# Altium schematic sheet Power.SchDoc
size A4
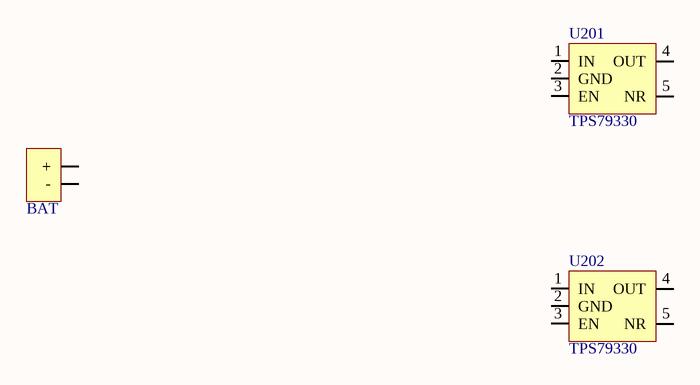
[diagram p0: Power.SchDoc]

## Parts
*  BAT
U201  TPS79330
U202  TPS79330

## Nets

Not connected (* = marked no-connect by the designer): * 1(+) 2(-); U201 1(IN) 2(GND) 3(EN) 4(OUT) 5(NR); U202 1(IN) 2(GND) 3(EN) 4(OUT) 5(NR)

## Library data of the parts
U201 U202 = TPS793??